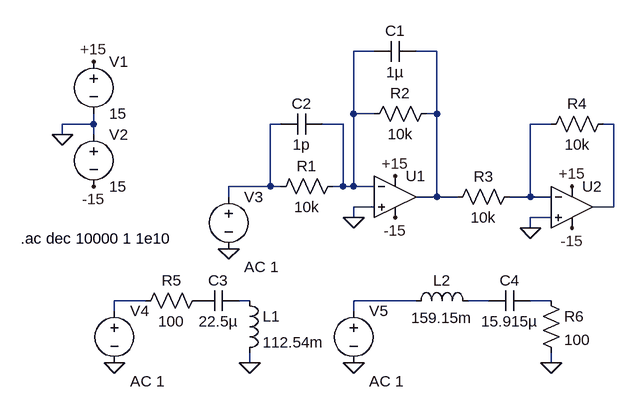
[diagram p0: schematic taller9.asc]
taller9.asc, the LTspice schematic file:
Version 4
SHEET 1 1152 680
WIRE 496 -128 464 -128
WIRE 592 -128 560 -128
WIRE 464 -32 464 -128
WIRE 496 -32 464 -32
WIRE 592 -32 592 -128
WIRE 592 -32 576 -32
WIRE 64 -16 64 -32
WIRE 64 -16 16 -16
WIRE 352 -16 336 -16
WIRE 448 -16 416 -16
WIRE 768 -16 736 -16
WIRE 864 -16 848 -16
WIRE 16 0 16 -16
WIRE 64 0 64 -16
WIRE 336 80 336 -16
WIRE 336 80 272 80
WIRE 352 80 336 80
WIRE 448 80 448 -16
WIRE 448 80 432 80
WIRE 464 80 464 -32
WIRE 464 80 448 80
WIRE 496 80 464 80
WIRE 272 96 272 80
WIRE 592 96 592 -32
WIRE 592 96 560 96
WIRE 624 96 592 96
WIRE 736 96 736 -16
WIRE 736 96 704 96
WIRE 768 96 736 96
WIRE 496 112 464 112
WIRE 864 112 864 -16
WIRE 864 112 832 112
WIRE 464 128 464 112
WIRE 768 128 736 128
WIRE 736 144 736 128
WIRE 144 256 96 256
WIRE 304 256 288 256
WIRE 560 256 464 256
WIRE 672 256 640 256
WIRE 768 256 736 256
WIRE 96 272 96 256
WIRE 464 272 464 256
WIRE 304 352 304 336
WIRE 768 352 768 336
FLAG 16 0 0
FLAG 64 -112 +15
FLAG 64 80 -15
FLAG 272 176 0
FLAG 528 64 +15
FLAG 528 128 -15
FLAG 464 128 0
FLAG 800 80 +15
FLAG 800 144 -15
FLAG 736 144 0
FLAG 96 352 0
FLAG 304 352 0
FLAG 464 352 0
FLAG 768 352 0
SYMBOL OpAmps\\UniversalOpAmp 528 96 R0
SYMATTR InstName U1
SYMATTR Value2 Avol=1Meg GBW=1000000Meg Vos=0
SYMBOL voltage 64 -128 R0
SYMATTR InstName V1
SYMATTR Value 15
SYMBOL voltage 64 -16 R0
SYMATTR InstName V2
SYMATTR Value 15
SYMBOL res 448 64 R90
WINDOW 0 0 56 VBottom 2
WINDOW 3 32 56 VTop 2
SYMATTR InstName R1
SYMATTR Value 10k
SYMBOL voltage 272 80 R0
WINDOW 123 24 124 Left 2
WINDOW 39 0 0 Left 0
SYMATTR InstName V3
SYMATTR Value ""
SYMATTR Value2 AC 1
SYMBOL res 592 -48 R90
WINDOW 0 0 56 VBottom 2
WINDOW 3 32 56 VTop 2
SYMATTR InstName R2
SYMATTR Value 10k
SYMBOL cap 560 -144 R90
WINDOW 0 0 32 VBottom 2
WINDOW 3 32 32 VTop 2
SYMATTR InstName C1
SYMATTR Value 1µ
SYMBOL cap 416 -32 R90
WINDOW 0 0 32 VBottom 2
WINDOW 3 32 32 VTop 2
SYMATTR InstName C2
SYMATTR Value 1p
SYMBOL OpAmps\\UniversalOpAmp 800 112 R0
SYMATTR InstName U2
SYMATTR Value2 Avol=1Meg GBW=1000000Meg Vos=0
SYMBOL res 720 80 R90
WINDOW 0 0 56 VBottom 2
WINDOW 3 32 56 VTop 2
SYMATTR InstName R3
SYMATTR Value 10k
SYMBOL res 864 -32 R90
WINDOW 0 0 56 VBottom 2
WINDOW 3 32 56 VTop 2
SYMATTR InstName R4
SYMATTR Value 10k
SYMBOL voltage 96 256 R0
WINDOW 123 24 124 Left 2
WINDOW 39 0 0 Left 0
SYMATTR InstName V4
SYMATTR Value ""
SYMATTR Value2 AC 1
SYMBOL res 240 240 R90
WINDOW 0 0 56 VBottom 2
WINDOW 3 32 56 VTop 2
SYMATTR InstName R5
SYMATTR Value 100
SYMBOL cap 288 240 R90
WINDOW 0 0 32 VBottom 2
WINDOW 3 32 32 VTop 2
SYMATTR InstName C3
SYMATTR Value 22.5µ
SYMBOL ind 288 240 R0
SYMATTR InstName L1
SYMATTR Value 112.54m
SYMBOL voltage 464 256 R0
WINDOW 123 24 124 Left 2
WINDOW 39 0 0 Left 0
SYMATTR InstName V5
SYMATTR Value ""
SYMATTR Value2 AC 1
SYMBOL cap 736 240 R90
WINDOW 0 0 32 VBottom 2
WINDOW 3 32 32 VTop 2
SYMATTR InstName C4
SYMATTR Value 15.915µ
SYMBOL res 752 240 R0
SYMATTR InstName R6
SYMATTR Value 100
SYMBOL ind 544 272 R270
WINDOW 0 32 56 VTop 2
WINDOW 3 5 56 VBottom 2
SYMATTR InstName L2
SYMATTR Value 159.15m
TEXT -48 160 Left 2 !.ac dec 10000 1 1e10

The netlist it stands for:
* taller9.asc
XU1 0 N001 +15 -15 N002 level1 Avol=1Meg GBW=1000000Meg Vos=0 En=0 Enk=0 In=0 Ink=0 Rin=500Meg  ; pins In+ In- V+ V- OUT
V1 +15 0 15
V2 0 -15 15
R1 N001 N003 10k
V3 N003 0 AC 1
R2 N002 N001 10k
C1 N002 N001 1µ
C2 N001 N003 1p
XU2 0 N004 +15 -15 N005 level1 Avol=1Meg GBW=1000000Meg Vos=0 En=0 Enk=0 In=0 Ink=0 Rin=500Meg  ; pins In+ In- V+ V- OUT
R3 N004 N002 10k
R4 N005 N004 10k
V4 N006 0 AC 1
R5 P001 N006 100
C3 N007 P001 22.5µ
L1 N007 0 112.54m
V5 N008 0 AC 1
C4 N010 N009 15.915µ
R6 N010 0 100
L2 N008 N009 159.15m
.ac dec 10000 1 1e10
.lib UniversalOpAmp1.lib
.backanno
.end